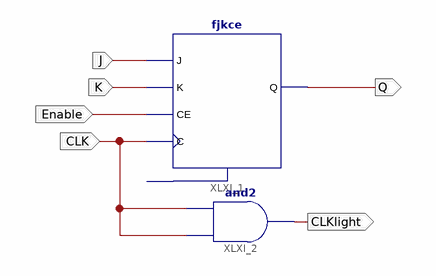
[diagram p0: schematic sheet 1]
// Xilinx ISE schematic Exp9.sch (spartan3e) as structural Verilog: 2 symbols, 6 ports
module Exp9 (
  input  CLK,
  input  J,
  input  K,
  input  Enable,
  output Q,
  output CLKlight
);

  fjkce XLXI_1 (.C(CLK), .CE(Enable), .J(J), .K(K), .Q(Q));  // open: CLR
  and XLXI_2 (CLKlight, CLK, CLK);
endmodule
